# Altium schematic sheet AltiumStm32Schematic.SchDoc
size A3; SheetNumber: 1; SheetTotal: 1
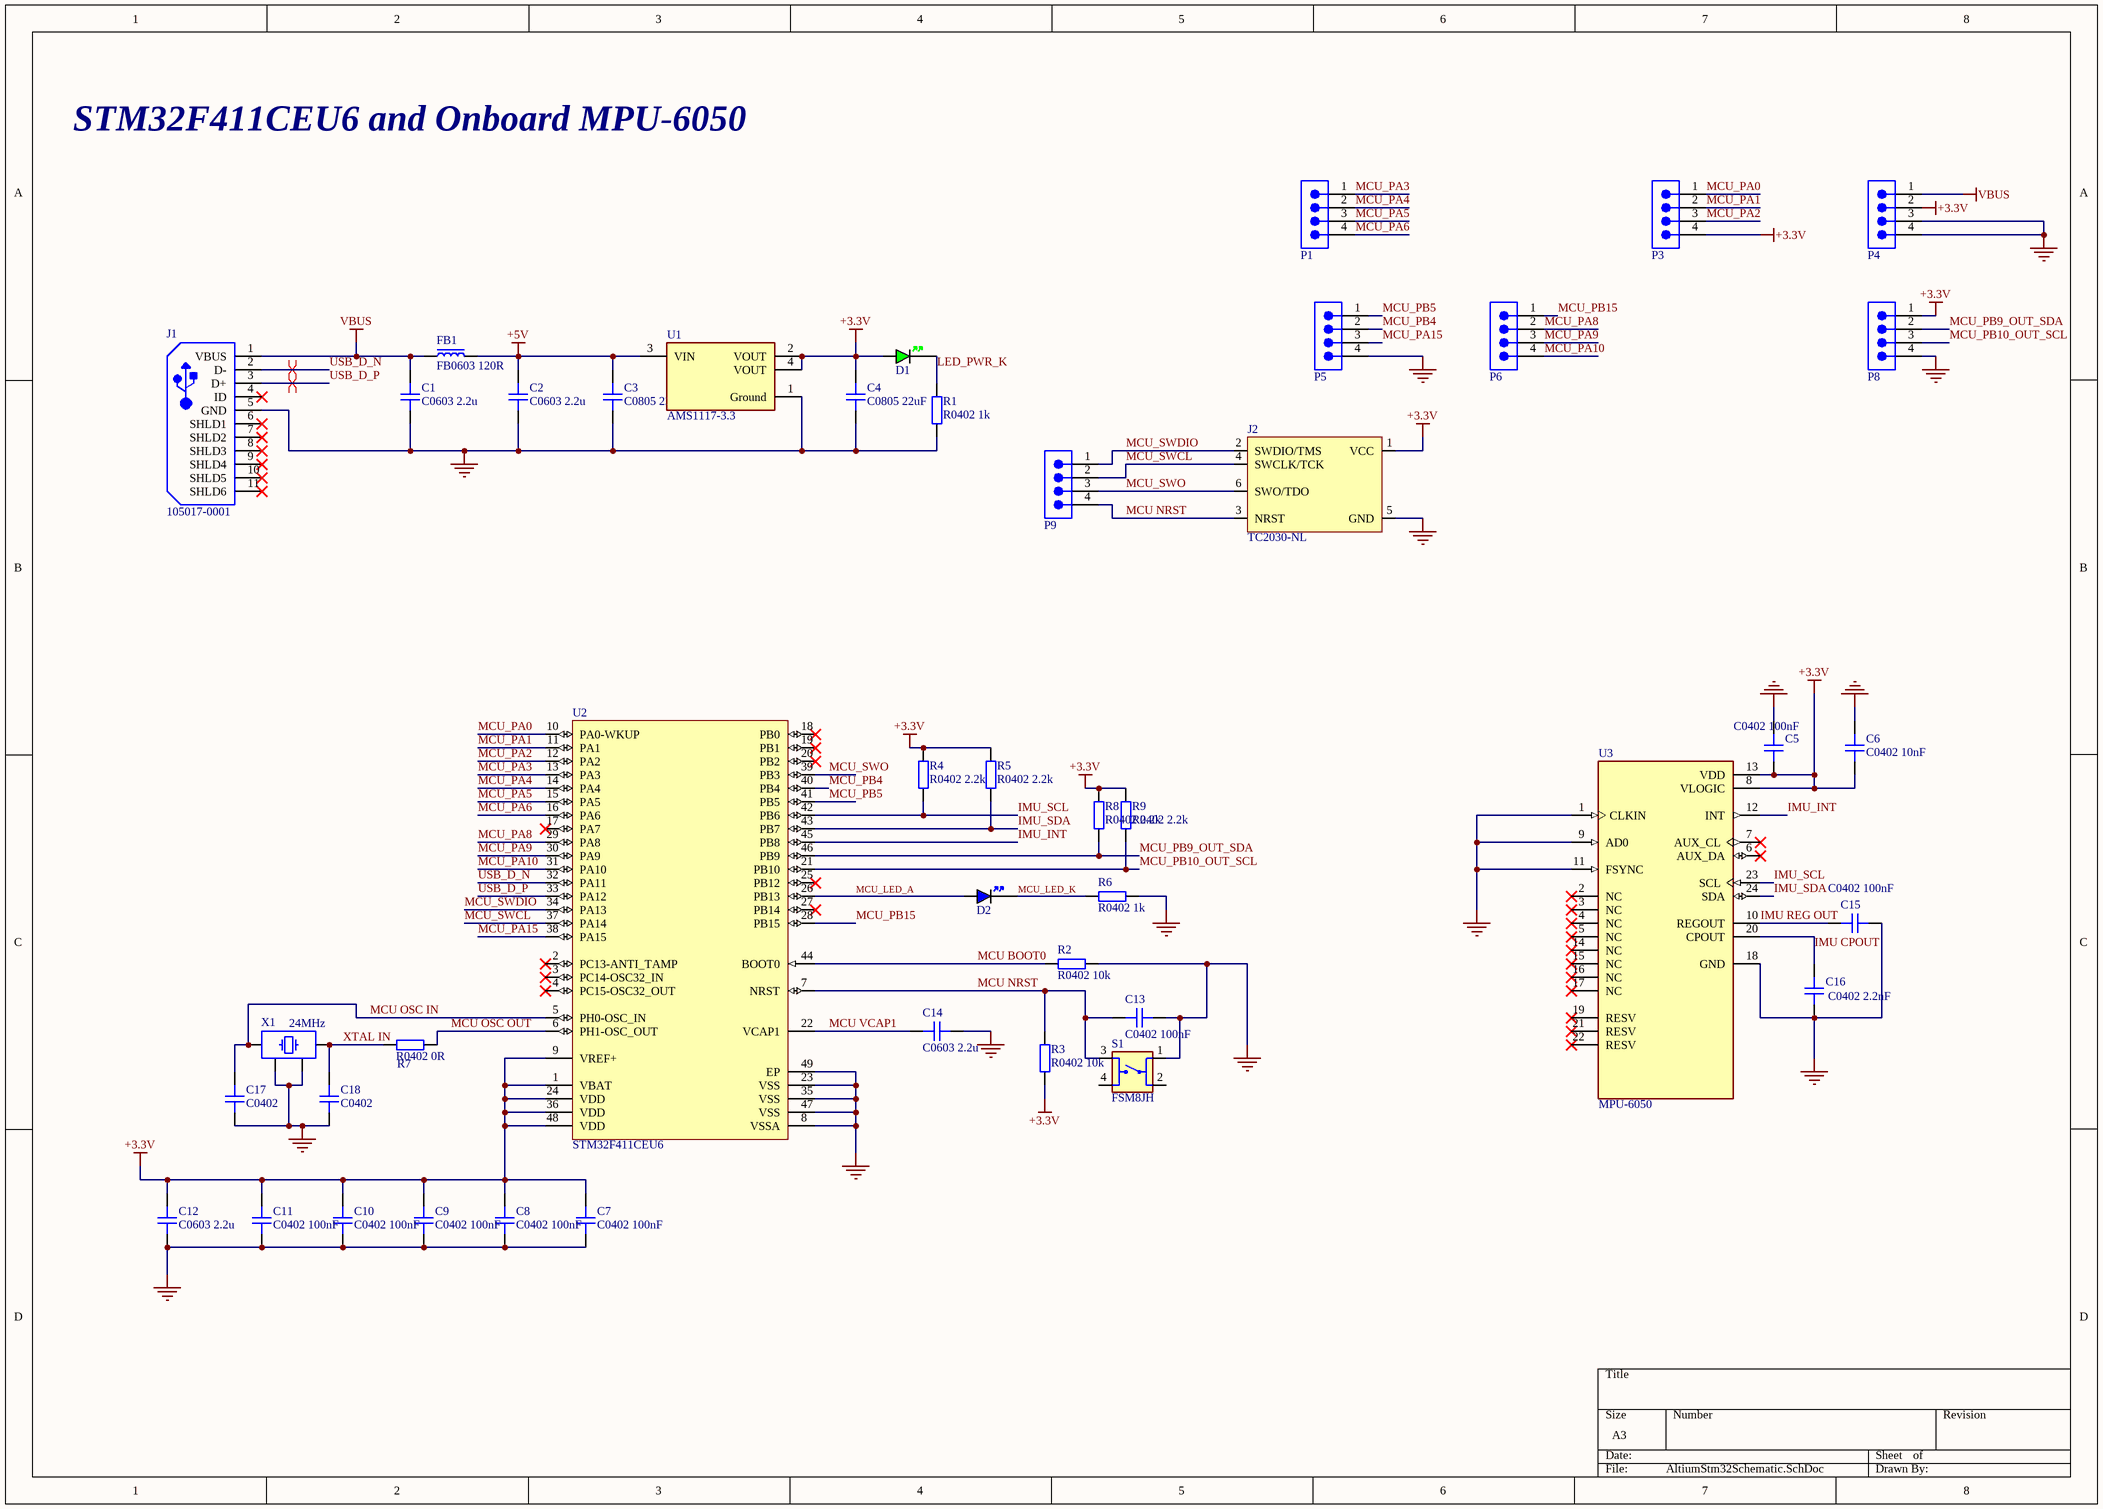
[diagram p0: AltiumStm32Schematic.SchDoc]

## Parts
C1  C0603 2.2u  [CAP_0603]
C2  C0603 2.2u  [CAP_0603]
C3  C0805 22uF  [CAP_0805]
C4  C0805 22uF  [CAP_0805]
C5  C0402 100nF  [CAP_0402]
C6  C0402 10nF  [CAP_0402]
C7  C0402 100nF  [CAP_0402]
C8  C0402 100nF  [CAP_0402]
C9  C0402 100nF  [CAP_0402]
C10  C0402 100nF  [CAP_0402]
C11  C0402 100nF  [CAP_0402]
C12  C0603 2.2u  [CAP_0603]
C13  C0402 100nF  [CAP_0402]
C14  C0603 2.2u  [CAP_0603]
C15  C0402 100nF  [CAP_0402]
C16  C0402 2.2nF  [CAP_0402]
C17  C0402  [CAP_0402]
C18  C0402  [CAP_0402]
D1  GREEN  [LED_0402_GREEN]  (value not drawn)
D2  BLUE  [LED_0402_BLUE]  (value not drawn)
FB1  FB0603 120R  [FB_0603]
J1  105017-0001  [USB-MICRO-B_V]
J2  TC2030-NL  [TC2030-NL-FP]  (no BOM)
P1  61300411121  [61300411121]  (value not drawn)
P3  61300411121  [61300411121]  (value not drawn)
P4  61300411121  [61300411121]  (value not drawn)
P5  61300411121  [61300411121]  (value not drawn)
P6  61300411121  [61300411121]  (value not drawn)
P8  61300411121  [61300411121]  (value not drawn)
P9  61300411121  [61300411121]  (value not drawn)
R1  R0402 1k  [RES_0402]
R2  R0402 10k  [RES_0402]
R3  R0402 10k  [RES_0402]
R4  R0402 2.2k  [RES_0402]
R5  R0402 2.2k  [RES_0402]
R6  R0402 1k  [RES_0402]
R7  R0402 0R  [RES_0402]
R8  R0402 2.2k  [RES_0402]
R9  R0402 2.2k  [RES_0402]
S1  FSM8JH  [SW_FSM8JH]
U1  AMS1117-3.3  [FP-AMS1117-IPC_C]
U2  STM32F411CEU6  [STM-UFQFPN48_L]
U3  MPU-6050  [QFN50P400X400X95-24N]
X1  24MHz  [XTAL_3225]

## Nets
+3.3V: C4.2 C5.1 C6.1 C7.1 C8.1 C9.1 C10.1 C11.1 C12.2 D1.A J2.1(VCC) P3.4 P4.2 P8.1 R3.2 R4.2 R5.2 R8.2 R9.2 U1.2(VOUT) U1.4(VOUT) U2.1(VBAT) U2.9(VREF+) U2.24(VDD) U2.36(VDD) U2.48(VDD) U3.8(VLOGIC) U3.13(VDD)
+5V: C2.2 C3.2 FB1.2 U1.3(VIN)
GND: C1.1 C2.1 C3.1 C4.1 C5.2 C6.2 C7.2 C8.2 C9.2 C10.2 C11.2 C12.1 C13.1 C14.1 C15.2 C16.1 C17.1 C18.1 J1.5(GND) J2.5(GND) P4.3 P4.4 P5.4 P8.4 R1.1 R2.1 R6.1 S1.1 U1.1(Ground) U2.8(VSSA) U2.23(VSS) U2.35(VSS) U2.47(VSS) U2.49(EP) U3.1(CLKIN) U3.9(AD0) U3.11(FSYNC) U3.18(GND) X1.2 X1.4
VBUS: C1.2 FB1.1 J1.1(VBUS) P4.1
IMU CPOUT: C16.2 U3.20(CPOUT)
IMU REG OUT: C15.1 U3.10(REGOUT)
IMU_INT: U2.45(PB8) U3.12(INT)
IMU_SCL: R4.1 U2.42(PB6) U3.23(SCL)
IMU_SDA: R5.1 U2.43(PB7) U3.24(SDA)
LED_PWR_K: D1.K R1.2
MCU BOOT0: R2.2 U2.44(BOOT0)
MCU NRST: C13.2 J2.3(NRST) P9.4 R3.1 S1.3 U2.7(NRST)
MCU OSC IN: C17.2 U2.5(PH0-OSC_IN) X1.1
MCU OSC OUT: R7.2 U2.6(PH1-OSC_OUT)
MCU VCAP1: C14.2 U2.22(VCAP1)
MCU_LED_A: D2.A U2.26(PB13)
MCU_LED_K: D2.K R6.2
MCU_PA0: P3.1 U2.10(PA0-WKUP)
MCU_PA1: P3.2 U2.11(PA1)
MCU_PA2: P3.3 U2.12(PA2)
MCU_PA3: P1.1 U2.13(PA3)
MCU_PA4: P1.2 U2.14(PA4)
MCU_PA5: P1.3 U2.15(PA5)
MCU_PA6: P1.4 U2.16(PA6)
MCU_PA8: P6.2 U2.29(PA8)
MCU_PA9: P6.3 U2.30(PA9)
MCU_PA10: P6.4 U2.31(PA10)
MCU_PA15: P5.3 U2.38(PA15)
MCU_PB4: P5.2 U2.40(PB4)
MCU_PB5: P5.1 U2.41(PB5)
MCU_PB9_OUT_SDA: P8.2 R8.1 U2.46(PB9)
MCU_PB10_OUT_SCL: P8.3 R9.1 U2.21(PB10)
MCU_PB15: P6.1 U2.28(PB15)
MCU_SWCL: J2.4(SWCLK/TCK) P9.2 U2.37(PA14)
MCU_SWDIO: J2.2(SWDIO/TMS) P9.1 U2.34(PA13)
MCU_SWO: J2.6(SWO/TDO) P9.3 U2.39(PB3)
USB_D_N: J1.2(D-) U2.32(PA11)
USB_D_P: J1.3(D+) U2.33(PA12)
XTAL IN: C18.2 R7.1 X1.3

Not connected (* = marked no-connect by the designer): J1 4(ID)* 6(SHLD1)* 7(SHLD2)* 8(SHLD3)* 9(SHLD4)* 10(SHLD5)* 11(SHLD6)*; S1 2 4; U2 2(PC13-ANTI_TAMP)* 3(PC14-OSC32_IN)* 4(PC15-OSC32_OUT)* 17(PA7)* 18(PB0)* 19(PB1)* 20(PB2)* 25(PB12)* 27(PB14)*; U3 2(NC)* 3(NC)* 4(NC)* 5(NC)* 6(AUX_DA)* 7(AUX_CL)* 14(NC)* 15(NC)* 16(NC)* 17(NC)* 19(RESV)* 21(RESV)* 22(RESV)*

## Layout directives
differential pair; differential pair class DIFF_USB: USB_D_N, USB_D_P

## Notes on the sheet
- STM32F411CEU6 and Onboard MPU-6050

## Library data of the parts
C1 C2 C12 C14 = CAP_0603: Capacitor SMD 0603; Manufacturer: *; Manufacturer Part Number: *; Distributor Link: *; LCSC: *; Rating: *; Dielectric: *
C3 C4 = CAP_0805: Capacitor SMD 0805 16V; Manufacturer: *; Manufacturer Part Number: *; Distributor Link: *; LCSC: *; Rating: *; Dielectric: *
C5-C11 C13 C15 C16 = CAP_0402: Capacitor SMD 0402; Manufacturer: *; Manufacturer Part Number: *; Distributor Link: *; LCSC: *; Rating: *; Dielectric: *
C17 C18 = CAP_0402: Capacitor SMD 0402 / udemy'e göre 10pf; Manufacturer: *; Manufacturer Part Number: *; Distributor Link: *; LCSC: *; Rating: *; Dielectric: *
D1 = LED_0402_GREEN: LED 0402 GREEN SMD
D2 = LED_0402_BLUE: LED 0402 BLUE SMD
FB1 = FB_0603: Ferrite Bead SMD 0603; Manufacturer: *; Manufacturer Part Number: *; Distributor Link: *; LCSC: *
J1 = CMP-2000-05827-1: Micro-USB B Receptacle, Right Angle, Bottom Mount, Surface Mount, with Solder Tabs, -30 to 85 degC, 5-Pin USB, RoHS, Tape and Reel; Manufacturer: Molex; Featured Product: Micro-USBConnectorsUSBConnectors; Other Names: WM1399DKR; Package Version: Rev. F, 12/2012; Number of Contacts: 5; Connector Type: USB-microB; Catalog Drawings: 1050170001; 3D Model: 105017-0001.stp; Mating Products: WM17145-ND-CABLEMICROUSBBTOSTDA1.0MWM17147-ND-CABLEMICROUSBBTOSTDA2.0MWM17146-ND-CABLEMICROUSBBTOSTDA1.5M; PCN Assembly/Origin: ResinSupplier21/Oct/2015; Voltage - Max: 30V; Online Catalog: Molex-MicroUSB; Manufacturer URL: http://www.molex.com/; Package Description: 5-Leads USB, Micro B, Body 7.5 x 5 mm, Pitch 0.65 mm; Datasheet URL: http://www.molex.com/elqNow/elqRedir.htm?ref=http://www.molex.com/webdocs/datasheets/pdf/en-us/1050170001_IO_CONNECTORS.pdf; Ingress Protection: -; Datasheet Version: 03/2016; Mounting Type: BoardCutout,SurfaceMount,RightAngle; Circuits: 5; Standard Package: 1; Package Reference: MICRO-B; Package URL: http://www.molex.com/pdm_docs/sd/1050170001_sd.pdf; Category: Connectors,Interconnects; Series: -; RoHS Information: 1050170001CertofCompliance; Features: Shielded,SolderRetention; Family: USB,DVI,HDMIConnectors; Specifications: -; Gender: Receptacle; Packaging: Digi-Reel®; Mounting Technology: SurfaceMount
J2 = TC2030-NL: Tag-Connect No-Solder SWD Debug Connector (No Legs) DO NOT PLACE; Manufacturer: Tag-Connect; Manufacturer Part Number: TC2030-NL-FP
P1 P3-P6 P8 P9 = 61300411121: WR-PHD Pin Header, THT, Vertical, pitch 2.54mm, 1 Row, 4P; Manufacturer: Wurth Elektronik; Contact Resistance: 20mOhm; Rated Current: 3A; Working Voltage: 250V; Withstanding Voltage: 500V; Manufacturer Part Number: 61300411121; Category: Board-to-Board Connectors; Match Code: WR-PHD; ComponentLink1Description: Website Link; ComponentLink1URL: https://www.we-online.com/redexpert/article/61300411121?ad; ComponentLink2Description: Datasheet Link; ComponentLink2URL: https://www.we-online.com/redexpert/spec/61300411121?ad; Mount: Through Hole; Operating Temperature Max: 105°C; Operating Temperature Min: -40°C; Packaging: Bag; Gender: Pin Header; Number of Pins: 4; Number of Rows: 1; Orientation: Vertical; Pitch: 2.54mm
R1-R9 = RES_0402: Resistor SMD 0402; Manufacturer: *; Manufacturer Part Number: *; Distributor Link: *; LCSC: *
S1 = FSM8JH: Tactile Switch SPST-NO Top Actuated Through Hole; MF: TE Connectivity; Check_prices: https://www.snapeda.com/parts/FSM8JH/TE+Connectivity+ALCOSWITCH+Switches/view-part/?ref=eda; Value: *; Availability: In Stock; MP: FSM8JH; Price: None; Package: None; SnapEDA_Link: https://www.snapeda.com/parts/FSM8JH/TE+Connectivity+ALCOSWITCH+Switches/view-part/?ref=snap
U1 = CMP-209535-000001-1: LDO Voltage Regulators 1A, 3.3V; Manufacturer: Advanced Monolithic Systems; Dropout Voltage: 1.1V; Output Type: Fixed; Nominal Supply Current: 5mA; Max Power Dissipation: 1.2W; Max Supply Voltage: 15V; Number Of Outputs: 1; Standoff Height: 0.64mm; Max Junction Temp: +125°C; Height: 1.8mm; Package: AMS1117; Device Class L2: Power Management ICs; ComponentLink2Description: Datasheet; ComponentLink2URL: http://www.advanced-monolithic.com/pdf/ds1117.pdf; Category: IC; RoHS: TRUE; Automotive: No; Device Class L1: Integrated Circuits (ICs); Output Current: 1A; Device Class L3: Voltage Regulators - Linear; Temperature: -40°C to +125°C; Output Voltage: 3.3V; Manufacturer Part Number: AMS1117-3.3; Temperature Range Low: -40°C; Octopart: https://octopart.com/ams1117-3.3-advanced+monolithic+systems-25899300; Lead Free: Yes; Ipc Land Pattern Name: SOT229P700X180-4; Temperature Range High: +125°C
U2 = CMP-0243-00165-1: ARM Cortex-M4 32-bit MCU+FPU, 512 KB Flash, 128 KB RAM, 36 I/Os, 48-Pin UFQFPN, -40 to 85 degC, Tray; Operating Frequency(F) (Processor speed) (MHz): 100; FLASH Size (Prog) (kB): 512; Internal RAM Size (kB): 128; I/Os (High Current): 36; Supply Voltage(Vcc) min (V): 1.7; Package Reference: 48-Pin Ultra Thin Fine Pitch Quad Flat No-Lead, 7 x 7 x 0.6 mm Body, 0.5 mm Pitch, Exposed Pad; ComponentLink1Description: Manufacturer URL; ComponentLink1URL: http://www.st.com/; Packing: Tray; Package Description: UFQFPN48; Core: ARM Cortex-M4; ComponentLink2Description: Datasheet; ComponentLink2URL: http://www.st.com/st-web-ui/static/active/en/resource/technical/document/datasheet/DM00115249.pdf; DatasheetVersion: Rev. 6; Mounting Technology: Surface Mount
U3 = MPU-6050: MPU-6050 series Accelerometer, Gyroscope, 3 Axis Sensor Evaluation Board; MF: TDK InvenSense; SnapEDA_Link: https://www.snapeda.com/parts/MPU-6050/TDK+InvenSense/view-part/?ref=snap; Package: QFN-24 InvenSense; Value: *; MP: MPU-6050; Check_prices: https://www.snapeda.com/parts/MPU-6050/TDK+InvenSense/view-part/?ref=eda
X1 = TSX-3225_24.0000MF15X-AC: Crystal SMD 24MHz 10PPM 7pF 3225; Manufacturer: Epson; Manufacturer Part Number: TSX-3225 24.0000MF15X-AC